# Altium project BLDC controller.PrjPcb
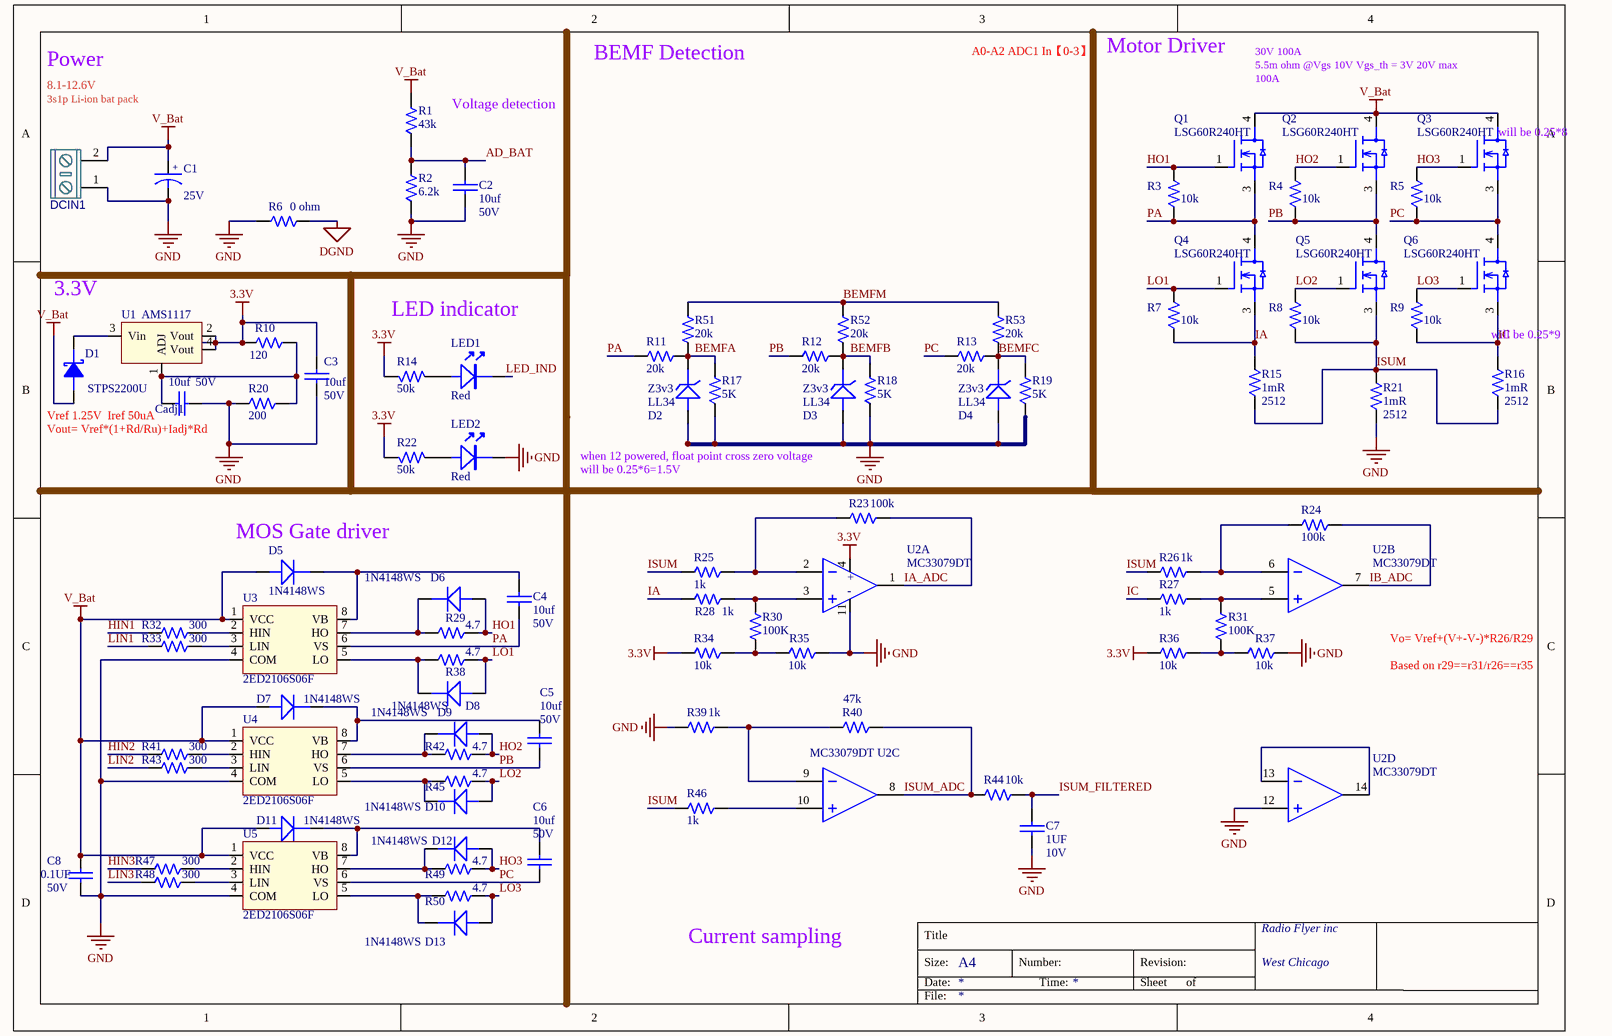
[diagram p0: E-scooter.SchDoc]
3 sheets, 132 parts. Net scope: global (net labels, ports and power ports of the same name join across sheets).
Board files: BLDC controller.PcbDoc, BLDC controlle_V2y.PcbDoc, BLDC controlle_V3.PcbDoc
Sheets:
  E-scooter.SchDoc
  Connector.SchDoc
  MCU.SchDoc

## Sheet E-scooter.SchDoc
size A4; Organization: Altium Limited; Address1: L3, 12a Rodborough Rd; Address2: Frenchs Forest; Address3: NSW; Address4: Australia 2086

### Parts
(Parts that share a designator on the sheet are numbered #1, #2 ... from top to bottom, then left to right.)
C1  Voltage: 25V  [CASE - G]  (hidden comment: PBE099550-4710)
C2  value 10uf  Voltage: 50V  [CAPC0603-RW]  (hidden comment: PXL456470-1530)
C3  value 10uf  Voltage: 50V  [CAPC0603-RW]  (hidden comment: PXL456470-1530)
C4  value 10uf  Voltage: 50V  [CAPC0603-RW]  (hidden comment: PXL456470-1530)
C5  value 10uf  Voltage: 50V  [CAPC0603-RW]  (hidden comment: PXL456470-1530)
C6  value 10uf  Voltage: 50V  [CAPC0603-RW]  (hidden comment: PXL456470-1530)
C7  value 1UF  Voltage: 10V  [CAPC0603-SW]  (hidden comment: PXL456470-1530)
C8  value 0.1UF  Voltage: 50V  [CAPC0603-RW]  (hidden comment: PXL456470-1530)
Cadj1  value 10uf  Voltage: 50V  [CAPC0603-RW]  (hidden comment: PXL456470-1530)
D1  MFG Part: STPS2200U  [SMB]  (hidden comment: DIO STPS2200U)
D2  MFG Part: Z3v3  [LL34]  (hidden comment: RCZ005015-0020)
D3  MFG Part: Z3v3  [LL34]  (hidden comment: RCZ005015-0020)
D4#1  MFG Part: Z3v3  [LL34]  (hidden comment: RCZ005015-0020)
D5#1  RCD114148-0020  [SOD-323]  (value not drawn)
D6#1  RCD114148-0020  [SOD-323]  (value not drawn)
D7#1  RCD114148-0020  [SOD-323]  (value not drawn)
D8#1  RCD114148-0020  [SOD-323]  (value not drawn)
D9  RCD114148-0020  [SOD-323]  (value not drawn)
D10  RCD114148-0020  [SOD-323]  (value not drawn)
D11  RCD114148-0020  [SOD-323]  (value not drawn)
D12  RCD114148-0020  [SOD-323]  (value not drawn)
D13  RCD114148-0020  [SOD-323]  (value not drawn)
DCIN1  KF/WJ/DG 30x connecter  [KF/WJ/DG 301-2p-5.0mm]  (value not drawn)
LED1  Color: Red  [LED1206-RED]  (hidden comment: LED1206R_23-21\R6C-AM1N2AY\2A)
LED2#1  Color: Red  [LED1206-RED]  (hidden comment: LED1206R_23-21\R6C-AM1N2AY\2A)
Q1  MFG Part: LSG60R240HT  [TO252-3]  (hidden comment: T5860038503A6)
Q2  MFG Part: LSG60R240HT  [TO252-3]  (hidden comment: T5860038503A6)
Q3  MFG Part: LSG60R240HT  [TO252-3]  (hidden comment: T5860038503A6)
Q4  MFG Part: LSG60R240HT  [TO252-3]  (hidden comment: T5860038503A6)
Q5  MFG Part: LSG60R240HT  [TO252-3]  (hidden comment: T5860038503A6)
Q6  MFG Part: LSG60R240HT  [TO252-3]  (hidden comment: T5860038503A6)
R1  value 43k  [0603-RW]  (hidden comment: T5024421083A9)
R2  value 6.2k  [0603-RW]  (hidden comment: T5024421083A9)
R3  value 10k  [0603-RW]  (hidden comment: T5024421083A9)
R4  value 10k  [0603-RW]  (hidden comment: T5024421083A9)
R5  value 10k  [0603-RW]  (hidden comment: T5024421083A9)
R6  value 0 ohm  [0603-RW]  (hidden comment: T502210202399)
R7  value 10k  [0603-RW]  (hidden comment: T5024421083A9)
R8  value 10k  [0603-RW]  (hidden comment: T5024421083A9)
R9  value 10k  [0603-RW]  (hidden comment: T5024421083A9)
R10  value 120  [0603-RW]  (hidden comment: T5024421083A9)
R11  value 20k  [0603-RW]  (hidden comment: T5024421083A9)
R12  value 20k  [0603-RW]  (hidden comment: T5024421083A9)
R13  value 20k  [0603-RW]  (hidden comment: T5024421083A9)
R14  value 50k  [0603-RW]  (hidden comment: T5024421083A9)
R15  value 1mR  [2512]  (hidden comment: QCF101250-1009)
R16  value 1mR  [2512]  (hidden comment: QCF101250-1009)
R17  value 5K  [0603-RW]  (hidden comment: T5024421083A9)
R18  value 5K  [0603-RW]  (hidden comment: T5024421083A9)
R19  value 5K  [0603-RW]  (hidden comment: T5024421083A9)
R20  value 200  [0603-RW]  (hidden comment: T5024421083A9)
R21  value 1mR  [2512]  (hidden comment: QCF101250-1009)
R22  value 50k  [0603-RW]  (hidden comment: T5024421083A9)
R23  value 100k  [0603-RW]  (hidden comment: T5024421083A9)
R24  value 100k  [0603-RW]  (hidden comment: T5024421083A9)
R25  value 1k  [0603-RW]  (hidden comment: T5024421083A9)
R26  value 1k  [0603-RW]  (hidden comment: T5024421083A9)
R27#1  value 1k  [0603-RW]  (hidden comment: T5024421083A9)
R28  value 1k  [0603-RW]  (hidden comment: T5024421083A9)
R29  value 4.7  [0603-RW]  (hidden comment: T5024421083A9)
R30#1  value 100K  [0603-RW]  (hidden comment: T5024421083A9)
R31  value 100K  [0603-RW]  (hidden comment: T5024421083A9)
R32#1  value 300  [0603-RW]  (hidden comment: T5024421083A9)
R33  value 300  [0603-RW]  (hidden comment: T5024421083A9)
R34  value 10k  [0603-RW]  (hidden comment: T5024421083A9)
R35  value 10k  [0603-RW]  (hidden comment: T5024421083A9)
R36  value 10k  [0603-RW]  (hidden comment: T5024421083A9)
R37  value 10k  [0603-RW]  (hidden comment: T5024421083A9)
R38  value 4.7  [0603-RW]  (hidden comment: T5024421083A9)
R39  value 1k  [0603-RW]  (hidden comment: T5024421083A9)
R40#1  value 47k  [0603-RW]  (hidden comment: T5024421083A9)
R41  value 300  [0603-RW]  (hidden comment: T5024421083A9)
R42  value 4.7  [0603-RW]  (hidden comment: T5024421083A9)
R43  value 300  [0603-RW]  (hidden comment: T5024421083A9)
R44  value 10k  [0603-RW]  (hidden comment: T5024421083A9)
R45  value 4.7  [0603-RW]  (hidden comment: T5024421083A9)
R46  value 1k  [0603-RW]  (hidden comment: T5024421083A9)
R47  value 300  [0603-RW]  (hidden comment: T5024421083A9)
R48  value 300  [0603-RW]  (hidden comment: T5024421083A9)
R49  value 4.7  [0603-RW]  (hidden comment: T5024421083A9)
R50  value 4.7  [0603-RW]  (hidden comment: T5024421083A9)
R51  value 20k  [0603-RW]  (hidden comment: T5024421083A9)
R52  value 20k  [0603-RW]  (hidden comment: T5024421083A9)
R53#1  value 20k  [0603-RW]  (hidden comment: T5024421083A9)
U1  AMS1117  [SOT223]
U2  RCI033079-0002  [SO14]  (value not drawn)  (parts A,B,C,D of 4)
U3  T610900027257  [SO8]  (value not drawn)
U4  T610900027257  [SO8]  (value not drawn)
U5  T610900027257  [SO8]  (value not drawn)

### Nets
3.3V: C3.1 R10.2 R14.1 R22.1 R34.2 R36.2 U1.2(Vout) U1.4(Vout) U2.4(+V)
DGND: R6.2
GND: C1.2 C2.2 C3.2 C7.1 C8.1 Cadj1.2 D2.1(A) D3.1(A) D4#1.1(A) DCIN1.1 LED2#1.2(K) R2.2 R6.1 R17.2 R18.2 R19.2 R20.2 R21.1 R35.1 R37.1 R39.2 U2.11(-V) U2.12(IN+) U3.4(COM) U4.4(COM) U5.4(COM)
V_Bat: C1.1 C8.2 D1.1(A) D5#1.1(A) D7#1.1(A) D11.1(A) DCIN1.2 Q1.4(D) Q2.4(D) Q3.4(D) R1.1 U3.1(VCC) U4.1(VCC) U5.1(VCC)
AD_BAT: C2.1 R1.2 R2.1
BEMFA: D2.2(K) R11.1 R17.1 R51.2
BEMFB: D3.2(K) R12.1 R18.1 R52.2
BEMFC: D4#1.2(K) R13.1 R19.1 R53#1.2
BEMFM: R51.1 R52.1 R53#1.1
HIN1: R32#1.2
HIN2: R41.2
HIN3: R47.2
HO1: D6#1.1(A) Q1.1(G) R3.2 R29.1
HO2: D9.1(A) Q2.1(G) R4.2 R42.1
HO3: D12.1(A) Q3.1(G) R5.2 R49.1
IA: Q4.3(S) R7.1 R15.2 R28.2
IA_ADC: R23.1 U2.1(OUT)
IB_ADC: R24.1 U2.7(OUT)
IC: Q6.3(S) R9.1 R16.2 R27#1.2
ISUM: Q5.3(S) R8.1 R15.1 R16.1 R21.2 R25.2 R26.2 R46.2
ISUM_ADC: R40#1.1 R44.2 U2.8(OUT)
ISUM_FILTERED: C7.2 R44.1
LED_IND: LED1.2(K)
LIN1: R33.2
LIN2: R43.2
LIN3: R48.2
LO1: D8#1.1(A) Q4.1(G) R7.2 R38.1
LO2: D10.1(A) Q5.1(G) R8.2 R45.1
LO3: D13.1(A) Q6.1(G) R9.2 R50.1
PA: C4.1 Q1.3(S) Q4.4(D) R3.1 R11.2 U3.6(VS)
PB: C5.1 Q2.3(S) Q5.4(D) R4.1 R12.2 U4.6(VS)
PC: C6.1 Q3.3(S) Q6.4(D) R5.1 R13.2 U5.6(VS)
NetC4_2: C4.2 D5#1.2(K) U3.8(VB)
NetC5_2: C5.2 D7#1.2(K) U4.8(VB)
NetC6_2: C6.2 D11.2(K) U5.8(VB)
NetCadj1_1: Cadj1.1 R10.1 R20.1 U1.1(ADJ)
NetD1_2: D1.2(K) U1.3(Vin)
NetD6#1_2: D6#1.2(K) R29.2 U3.7(HO)
NetD8#1_2: D8#1.2(K) R38.2 U3.5(LO)
NetD9_2: D9.2(K) R42.2 U4.7(HO)
NetD10_2: D10.2(K) R45.2 U4.5(LO)
NetD12_2: D12.2(K) R49.2 U5.7(HO)
NetD13_2: D13.2(K) R50.2 U5.5(LO)
NetLED1_1: LED1.1(A) R14.2
NetLED2#1_1: LED2#1.1(A) R22.2
NetR23_2: R23.2 R25.1 U2.2(IN-)
NetR24_2: R24.2 R26.1 U2.6(IN-)
NetR27#1_1: R27#1.1 R31.1 U2.5(IN+)
NetR28_1: R28.1 R30#1.1 U2.3(IN+)
NetR30#1_2: R30#1.2 R34.1 R35.2
NetR31_2: R31.2 R36.1 R37.2
NetR32#1_1: R32#1.1 U3.2(HIN)
NetR33_1: R33.1 U3.3(LIN)
NetR39_1: R39.1 R40#1.2 U2.9(IN-)
NetR41_1: R41.1 U4.2(HIN)
NetR43_1: R43.1 U4.3(LIN)
NetR46_1: R46.1 U2.10(IN+)
NetR47_1: R47.1 U5.2(HIN)
NetR48_1: R48.1 U5.3(LIN)
NetU2_13: U2.13(IN-) U2.14(OUT)

### Notes on the sheet
- Power
- 3s1p Li-ion bat pack
- 8.1-12.6V
- (near R1) Voltage detection
- BEMF Detection
- A0-A2 ADC1 In【0-3】
- Motor Driver
- 30V 100A
- 5.5m ohm @Vgs 10V Vgs_th = 3V 20V max
- (near Q1) 100A
- (near Q3) will be 0.25*8
- 3.3V
- LED indicator
- will be 0.25*9
- (near Cadj1) Vref 1.25V  Iref 50uA
- Vout= Vref*(1+Rd/Ru)+Iadj*Rd
- when 12 powered, float point cross zero voltage
- will be 0.25*6=1.5V
- (near D5#1) MOS Gate driver
- Vo= Vref+(V+-V-)*R26/R29
- Based on r29==r31/r26==r35
- Current sampling
- Title
- Size:
- Date:
- A4
- Number:
- Time:
- Revision:
- Sheet
- of
- Radio Flyer inc
- West Chicago
- File:
- (in symbol CAP E 470uF 25V 20% SMD) +
- (in symbol MC33079DT, part A) +; -

### Library data of the parts
C1 = CAP E 470uF 25V 20% SMD: CHIP ELECT 470uF 25V 20% D10xL10 105; SAP: T551471445000; Vendor Name: 东莞市晴远电子有限公司; Vendor Code: 10010262; Type: Capacitor; DIP&SMD: SMD; PACKAGE: CASE - G; MFG: *; MFG Part: *; Other: *; Tolerance: 20%; Customer Specific: N/A
C2-C8 = CAP0603 0.015uF 50V 10%: GP CHIP CAP 0.015uF 50V 10% 0603 TYPE X7R; SAP: T542021537508; Vendor Code: 10010262; Vendor Name: 东莞市晴远电子有限公司; Type: Capacitor; DIP&SMD: SMD; PACKAGE: CAPC0603; MFG: *; MFG Part: *; Other: X7R; Tolerance: 10%; Customer Specific: N/A
Cadj1 = CAP0603 0.015uF 50V 10%: GP CHIP CAP 0.015uF 50V 10% 0603 TYPE X7R; SAP: T542021537508; Vendor Code: 10010262; Vendor Name: 东莞市晴远电子有限公司; DIP&SMD: SMD; PACKAGE: CAPC0603; MFG: *; MFG Part: *; Other: X7R; Tolerance: 10%; Type: Capacitor; Customer Specific: N/A
D1 = DIO STPS2200U: DIODE SCHOTTKY 200V 2A SMB; MFG: STMicroelectronics; DIP&SMD: SMD; CREATE_NAME: Nathan; SAP: *; Vendor Name: *; Vendor Code: *; Voltage: *; Current: *; Type: DIODE; Customer Specific: N/A; CREATE_TIME: 19-Jun-2020; Package: SMB
D2 D3 D4#1 = TCLLZ15V: CHIP ZENER 15V 0.5W MLL34; SAP: T573003832016; Vendor Code: 10009207; Vendor Name: MOBICON HOLDINGS LTD.; MFG: TAK CHEONG; Current: 5MA; Tolerance: 5%; Power: 500MW; DIP&SMD: SMD; VOLTAGE: 15V; Type: ZENER; Customer Specific: N/A; Package: LL34
D5#1 D6#1 D7#1 D8#1 D9-D13 = 1N4148WS: DIODE SW 1N4148 VF=0.7V SOD-323; MFG: TW SEMICONDUCTOR; SAP: T572005070208; Voltage: 100V; Current: 150MA; DIP&SMD: SMD; Vendor Name: *; Vendor Code: *; Type: DIODE; Package: SOD-323; Customer Specific: N/A; MFG Part: 1N4148WS
DCIN1 = KF/WJ/DG 30x: 接线端子 2Pin
LED1 LED2#1 = LED1206R_23-21\R6C-AM1N2AY\2A: CHIP LED RED TYPE 1206; MFG: EVERLIGHT; DIP&SMD: SMD; CREATE_NAME: Nathan; MFG Part: 23-21\R6C-AM1N2AY\2A; SAP: *; Package: 1206; Type: LED; CREATE_TIME: 18-Aug-2020
Q1-Q6 = NMOS LSG60R240HT: NMOS 600V LSG60R240HT TO252( LONTEN K; Current: 17A; Type: N-CHANNEL MOSFET; CREATE_NAME: Nathan; DIP&SMD: SMD; SAP: T5860038503A6; Pd: *; Vendor Code: *; Vendor Name: *; Voltage: 600V; MFG: LONTEN; CREATE_TIME: 12-Oct-2019; Rds: *; Customer Specific: N/A; Package: TO252
R1-R5 R7-R14 R17-R20 R22-R26 R27#1 R28 R29 R30#1 R31 R32#1 R33-R39 R40#1 R41-R52 R53#1 = RES0201 1/20W 1% 4.42K OHM_WALSIN: CHIP 4.42K OHM 200PPM +-1% 0201 WALS L; MFG Part: WR02X4421FAL; Power: 1/20W; MFG: WALSIN (華新); TOL: 1%; CREATE_NAME: Nathan; DIP&SMD: SMD; Vendor Code: *; SAP: T5024421083A9; Vendor Name: *; Type: Resistor; PACKAGE: 0603; CREATE_TIME: 23-July-2019; Customer Specific: N/A
R6 = RES0603 1/16W 1% 21K OMH_WALSIN: CHIP 21K OHM 100PPM +-1% 0603 WALS L; TOL: 1%; MFG: WALSIN (華新); Power: 1/10W; CREATE_NAME: Nathan; DIP&SMD: SMD; SAP: T502210202399; Package: 0603; MFG Part: *; Vendor Code: *; Vendor Name: *; Type: Resistor; CREATE_TIME: 08-Feb-2018; Customer Specific: N/A
R15 R16 R21 = RES2512 1W 1% 10 OHM: CHIP RES. 10 OHM 1W 1% 2512; Vendor Code: 10010262; SAP: T502100A07399; Vendor Name: 东莞市晴远电子有限公司; DIP&SMD: SMD; Power: 1W; MFG Part: *; MFG: *; TOL: 1%; Type: Resistor; Customer Specific: N/A; PACKAGE: 2512
U1 = AMS1117: 800mA LOW DROPOUT VOLTAGE REGULATOR , SOT-223; MFG: Advanced Monolithic Systems; CREATE_NAME: Nathan; DIP&SMD: SMD; SAP: *; Vendor Code: *; Vendor Name: *; Type: IC; CREATE_TIME: 17-Nov-2020; Package: SOT-223; Customer Specific: N/A; MFG Part: AMS1117
U2 = MC33079DT: IC opamp quad MC33079 bipolar SO14; SAP: T610500026102; MFG: STMICROELECTRONICS; DIP&SMD: SMD; Vendor Code: *; Vendor Name: *; Type: IC; Customer Specific: N/A; MFG Part: MC33079DT
U3-U5 = 2ED2106S06F: DRIVER 2ED2106S06F DSO-8 INFINEO K; MFG: Infineon; CREATE_NAME: Nathan; DIP&SMD: SMD; Vendor Code: *; Vendor Name: *; SAP: T610900027257; Type: IC; CREATE_TIME: 14-Apr-2020; Customer Specific: N/A; MFG Part: 2ED2106S06F

## Sheet Connector.SchDoc
size A4; Organization: Altium Limited; Address1: L3, 12a Rodborough Rd; Address2: Frenchs Forest; Address3: NSW; Address4: Australia 2086
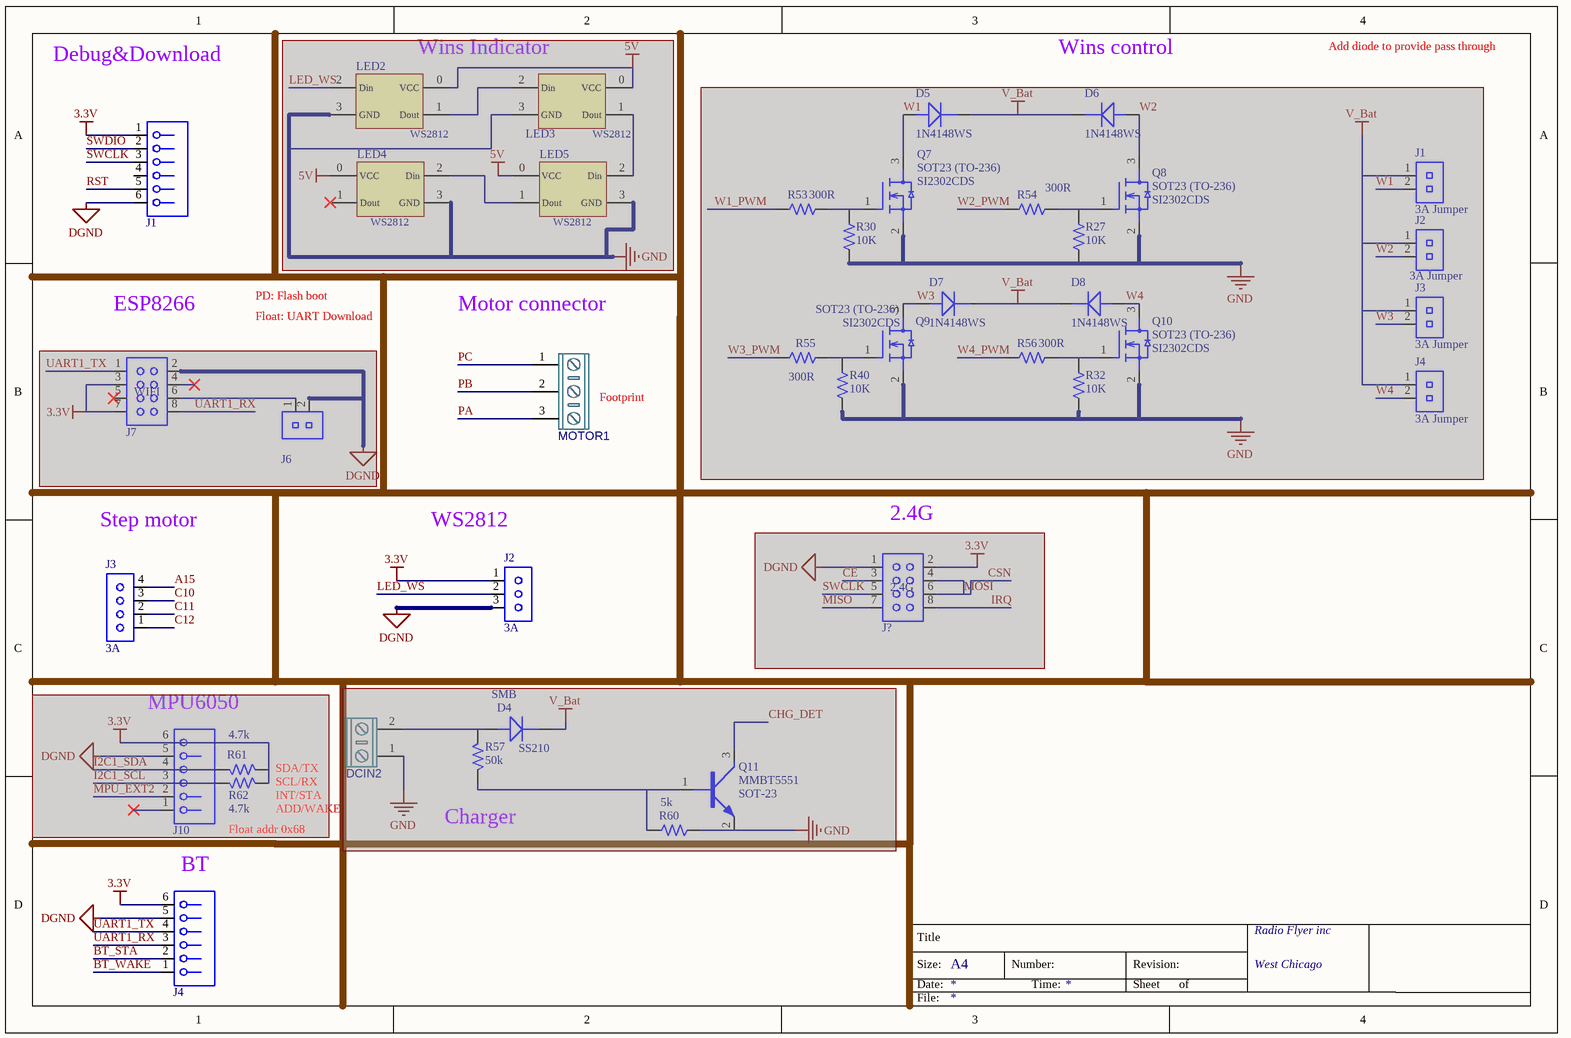
[diagram p1: Connector.SchDoc]

### Parts
(Parts that share a designator on the sheet are numbered #1, #2 ... from top to bottom, then left to right.)
D4#2  RCD102100-0110  [SMB]  (value not drawn)  (masked out: inside a compile mask, not in the netlist)
D5#2  RCD114148-0020  [SOD-323]  (value not drawn)  (masked out: inside a compile mask, not in the netlist)
D6#2  RCD114148-0020  [SOD-323]  (value not drawn)  (masked out: inside a compile mask, not in the netlist)
D7#2  RCD114148-0020  [SOD-323]  (value not drawn)  (masked out: inside a compile mask, not in the netlist)
D8#2  RCD114148-0020  [SOD-323]  (value not drawn)  (masked out: inside a compile mask, not in the netlist)
DCIN2  KF/WJ/DG 30x connecter  [KF/WJ/DG 301-2p-5.0mm]  (value not drawn)  (masked out: inside a compile mask, not in the netlist)
J1#1  Current: 3A Jumper  [HOUSING 2P PH=2.54mm Jumper]  (hidden comment: CCH254020-0102)  (masked out: inside a compile mask, not in the netlist)
J1#2  T690300121600  [CONN 6P PH=2.5mm RA XHB-6AW-KL]  (value not drawn)
J2#1  Current: 3A Jumper  [HOUSING 2P PH=2.54mm Jumper]  (hidden comment: CCH254020-0102)  (masked out: inside a compile mask, not in the netlist)
J2#2  Current: 3A  [HEAD 3P PH=2.54mm 180]  (hidden comment: CCP254010-0103)
J3#1  Current: 3A Jumper  [HOUSING 2P PH=2.54mm Jumper]  (hidden comment: CCH254020-0102)  (masked out: inside a compile mask, not in the netlist)
J3#2  Current: 3A  [HEAD 4P PH=2.54mm 180]  (hidden comment: CCP254260-0104)
J4#1  Current: 3A Jumper  [HOUSING 2P PH=2.54mm Jumper]  (hidden comment: CCH254020-0102)  (masked out: inside a compile mask, not in the netlist)
J4#2  T690300121600  [CONN 6P PH=2.5mm RA XHB-6AW-KL]  (value not drawn)
J6  CCH254020-0102  [HOUSING 2P PH=2.54mm Jumper]  (value not drawn)  (masked out: inside a compile mask, not in the netlist)
J7  WIFI  [HEAD 8P 2X4 PH=2.54mm 90 H5mm_2.54-2X4AW-10.4]  (masked out: inside a compile mask, not in the netlist)
J10  T690300121600  [CONN 6P PH=2.5mm RA XHB-6AW-KL]  (value not drawn)  (masked out: inside a compile mask, not in the netlist)
J?  2.4G  [HEAD 8P 2X4 PH=2.54mm 90 H5mm_2.54-2X4AW-10.4]  (masked out: inside a compile mask, not in the netlist)
LED2#2  WS2812  [WS2812]  (value not drawn)  (masked out: inside a compile mask, not in the netlist)
LED3  WS2812  [WS2812]  (value not drawn)  (masked out: inside a compile mask, not in the netlist)
LED4  WS2812  [WS2812]  (value not drawn)  (masked out: inside a compile mask, not in the netlist)
LED5  WS2812  [WS2812]  (value not drawn)  (masked out: inside a compile mask, not in the netlist)
MOTOR1  KF/WJ/DG 30x connecter  [KF/WJ/DG 301-3p-5.0mm]  (value not drawn)
Q7  Package: SOT23 (TO-236)  [SOT23-132-RW]  (hidden comment: SI2302CDS)  (masked out: inside a compile mask, not in the netlist)
Q8  Package: SOT23 (TO-236)  [SOT23-132-RW]  (hidden comment: SI2302CDS)  (masked out: inside a compile mask, not in the netlist)
Q9  Package: SOT23 (TO-236)  [SOT23-132-RW]  (hidden comment: SI2302CDS)  (masked out: inside a compile mask, not in the netlist)
Q10  Package: SOT23 (TO-236)  [SOT23-132-RW]  (hidden comment: SI2302CDS)  (masked out: inside a compile mask, not in the netlist)
Q11  Package: SOT-23  [SOT23-132-RW]  (hidden comment: RCN005551-0001)  (masked out: inside a compile mask, not in the netlist)
R27#2  value 10K  [0603-RW]  (hidden comment: T5024421083A9)  (masked out: inside a compile mask, not in the netlist)
R30#2  value 10K  [0603-RW]  (hidden comment: T5024421083A9)  (masked out: inside a compile mask, not in the netlist)
R32#2  value 10K  [0603-RW]  (hidden comment: T5024421083A9)  (masked out: inside a compile mask, not in the netlist)
R40#2  value 10K  [0603-RW]  (hidden comment: T5024421083A9)  (masked out: inside a compile mask, not in the netlist)
R53#2  value 300R  [0603-RW]  (hidden comment: T5024421083A9)  (masked out: inside a compile mask, not in the netlist)
R54  value 300R  [0603-RW]  (hidden comment: T5024421083A9)  (masked out: inside a compile mask, not in the netlist)
R55  value 300R  [0603-RW]  (hidden comment: T5024421083A9)  (masked out: inside a compile mask, not in the netlist)
R56  value 300R  [0603-RW]  (hidden comment: T5024421083A9)  (masked out: inside a compile mask, not in the netlist)
R57  value 50k  [0603-RW]  (hidden comment: T5024421083A9)  (masked out: inside a compile mask, not in the netlist)
R60  value 5k  [0603-RW]  (hidden comment: T5024421083A9)  (masked out: inside a compile mask, not in the netlist)
R61  value 4.7k  [0603-RW]  (hidden comment: T5024421083A9)  (masked out: inside a compile mask, not in the netlist)
R62  value 4.7k  [0603-RW]  (hidden comment: T5024421083A9)  (masked out: inside a compile mask, not in the netlist)

### Nets
3.3V: J1#2.1 J2#2.1 J4#2.6
DGND: J1#2.6 J2#2.3 J4#2.5
A15: J3#2.4
BT_STA: J4#2.2
BT_WAKE: J4#2.1
C10: J3#2.3
C11: J3#2.2
C12: J3#2.1
LED_WS: J2#2.2
PA: MOTOR1.3
PB: MOTOR1.2
PC: MOTOR1.1
RST: J1#2.5
SWCLK: J1#2.3
SWDIO: J1#2.2
UART1_RX: J4#2.3
UART1_TX: J4#2.4

Not connected (* = marked no-connect by the designer): J1#2 4

### Notes on the sheet
- Debug&Download
- Wins Indicator
- Wins control
- Add diode to provide pass through
- ESP8266
- PD: Flash boot
- (near MOTOR1) Motor connector
- Float: UART Download
- (near MOTOR1) Footprint
- (near J?) 2.4G
- Step motor
- (near J2#2) WS2812
- (near J10) MPU6050
- SDA/TX
- SCL/RX
- Float addr 0x68
- INT/STA
- ADD/WAKE
- (near R57) Charger
- BT
- Title
- Size:
- Date:
- A4
- Number:
- Time:
- Revision:
- Sheet
- of
- Radio Flyer inc
- West Chicago
- File:

### Library data of the parts
D4#2 = SS210: SWITC 100V 2A SS210 MIC G; SAP: T572005362246; Vendor Name: 深圳市春明电子有限公司; Vendor Code: 10020343; Type: DIODE; Optional: USD (和572004962246 交易幣別不一樣)帋ISHIDDEN=T|IS|IS|IS|IS|IS|IS; DIP&SMD: SMD; MFG: MIC; Voltage: 100V; Current: 2A; Customer Specific: N/A; MFG Part: SS210; Package: SMB
D5#2 D6#2 D7#2 D8#2 = 1N4148WS: as D5#1 on sheet E-scooter; Vendor Name: *; Vendor Code: *; Type: DIODE; Package: SOD-323; Customer Specific: N/A; MFG Part: 1N4148WS
DCIN2 = KF/WJ/DG 30x: 接线端子 2Pin
J1#1 J2#1 J3#1 J4#1 = HOUSING 2P PH=2.54mm Jumper: HOUSING SIL Jumper 2P 90059-1007 Molex; Value: 2.54mm; SAP: T690300000900; Vendor Name: 深圳市利民丰电子有限公司; Vendor Code: 10020373; DIP&SMD: DIP; MFG: *; MFG Part: *; Type: Connector
J1#2 J4#2 J10 = CONN PH 6P PH=2.5mm RA XHB-6AW-KL: CONNECTOR 6PIN P=2.5 WHITE 90 K; Value: 2.5mm; MFG: 金佳电子; CREATE_NAME: Nathan; DIP&SMD: DIP; SAP: T690300121600; MFG Part: XHB-6AW-KL; Vendor Name: *; Vendor Code: *; Type: Connector; Current: *; CREATE_TIME: 27-Sep-2017
J2#2 = HEAD 3P PH=2.54mm 180: HEAD PIN 3P P2.54*H11.6MM; Value: 2.54mm; SAP: T690300031100; Vendor Name: 深圳市利民丰电子有限公司; Vendor Code: 10020373; DIP&SMD: DIP; MFG: *; MFG Part: *; Type: Connector
J3#2 = HEAD 4P PH=2.54mm 180 H11.5mm: HEAD PIN 4P P2.54xH11.5MM; Value: 2.54mm; SAP: T690300023200; Vendor Name: 亿源电子有限公司; Vendor Code: 10009989; DIP&SMD: DIP; MFG: *; MFG Part: *; Type: Connector
J6 = HOUSING 2P PH=2.54mm Jumper: HOUSING SIL Jumper 2P 90059-1007 Molex; Value: 2.54mm; SAP: T690300000900; Vendor Name: 深圳市利民丰电子有限公司; Vendor Code: 10020373; DIP&SMD: DIP; Current: 3A Jumper; MFG: *; MFG Part: *; Type: Connector
J7 J? = HEAD 8P 2X4 PH=2.54mm 90 H5mm_2.54-2X4AW-10.4: 2X4P P:2.54MM 90° DIP K; Value: 2.54mm; SAP: T690300110000; MFG: JINJIA; CREATE_NAME: Nathan; MFG Part: 2.54-2X4AW-10.4; Vendor Name: *; Vendor Code: *; Type: Connector; Current: *; CREATE_TIME: 12-Sep-2017; DIP&SMD: DIP
MOTOR1 = KF/WJ/DG 30x-3P: 接线端子 3Pin
Q7-Q10 = SI2302CDS: NMOS FET-Si2302CDS; MFG: VISHAY; CREATE_NAME: Nathan; DIP&SMD: SMD; SAP: *; Power: *; Vendor Code: *; Vendor Name: *; Voltage: *; Current: *; Type: NMOS; CREATE_TIME: 17-Nov-2020; Customer Specific: N/A; MFG Part: SI2302CDS
Q11 = MMBT5551: XISTR NPN MMBT5551 SOT-23 FAIRCHILD; SAP: T581001790453; MFG: 宣瑜; Vendor Code: 10020343; Vendor Name: 深圳市春明电子有限公司; DIP&SMD: SMD; Power: *; Voltage: *; Type: NPN; Customer Specific: N/A; MFG Part: MMBT5551
R27#2 R30#2 R32#2 R40#2 R53#2 R54-R57 R60-R62 = RES0201 1/20W 1% 4.42K OHM_WALSIN: as R1 on sheet E-scooter; Vendor Code: *; SAP: T5024421083A9; Vendor Name: *; Type: Resistor; PACKAGE: 0603; CREATE_TIME: 23-July-2019; Customer Specific: N/A

## Sheet MCU.SchDoc
size A4
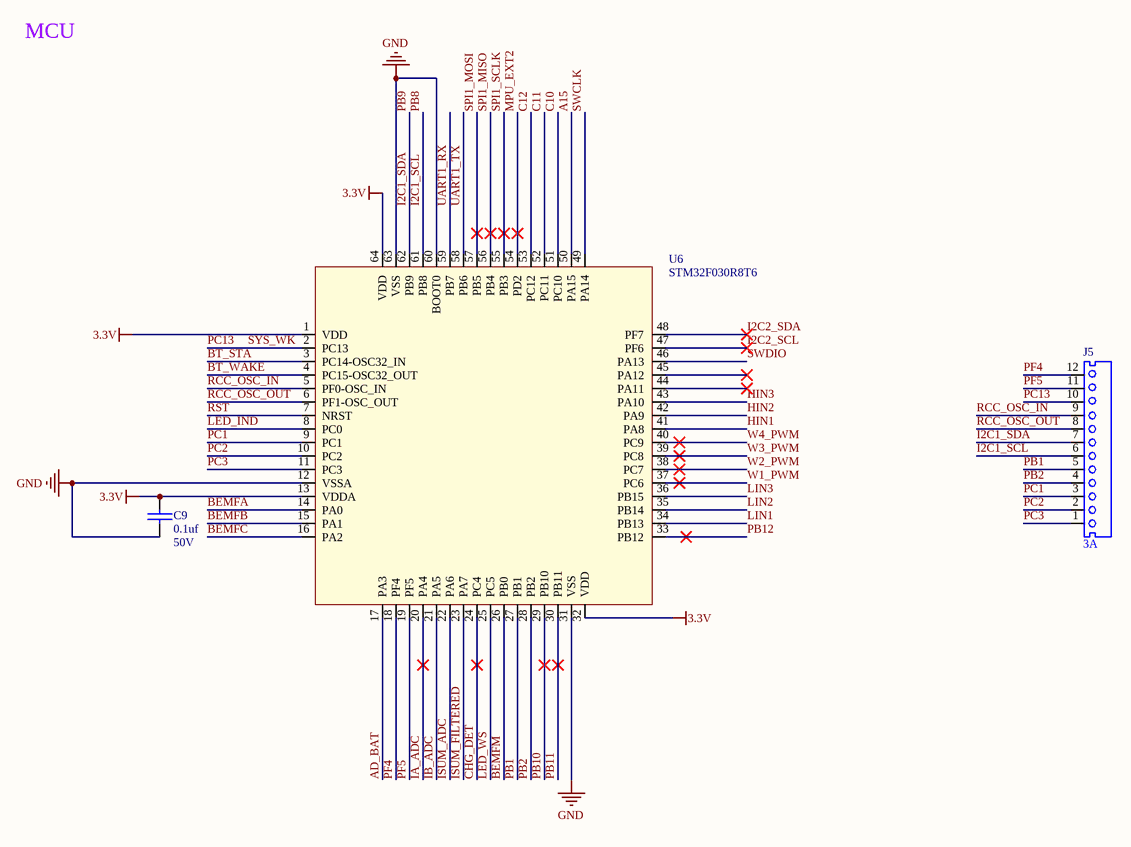
[diagram p2: MCU.SchDoc]

### Parts
C9  value 0.1uf  Voltage: 50V  [CAPC0603-RW]  (hidden comment: PXL456470-1530)
J5  Current: 3A  [CONN 12P PH=2.5 ST HAA250A-12A]  (hidden comment: T690300029300)
U6  MFG Part: STM32F030R8T6  [QFP50P1200X1200X160-64N]  (hidden comment: T610300097225)

### Nets
3.3V: C9.2 U6.1(VDD) U6.13(VDDA) U6.32(VDD) U6.64(VDD)
GND: C9.1 U6.12(VSSA) U6.31(VSS) U6.60(BOOT0) U6.63(VSS)
A15: U6.50(PA15)
AD_BAT: U6.17(PA3)
BEMFA: U6.14(PA0)
BEMFB: U6.15(PA1)
BEMFC: U6.16(PA2)
BEMFM: U6.26(PB0)
BT_STA: U6.3(PC14-OSC32_IN)
BT_WAKE: U6.4(PC15-OSC32_OUT)
C10: U6.51(PC10)
C11: U6.52(PC11)
C12: U6.53(PC12)
CHG_DET: U6.24(PC4)
HIN1: U6.41(PA8)
HIN2: U6.42(PA9)
HIN3: U6.43(PA10)
I2C1_SCL: J5.6 U6.61(PB8)  [also labelled PB8]
I2C1_SDA: J5.7 U6.62(PB9)  [also labelled PB9]
I2C2_SCL: U6.47(PF6)
I2C2_SDA: U6.48(PF7)
IA_ADC: U6.20(PA4)
IB_ADC: U6.21(PA5)
ISUM_ADC: U6.22(PA6)
ISUM_FILTERED: U6.23(PA7)
LED_IND: U6.8(PC0)
LED_WS: U6.25(PC5)
LIN1: U6.34(PB13)
LIN2: U6.35(PB14)
LIN3: U6.36(PB15)
MPU_EXT2: U6.54(PD2)
PB1: J5.5 U6.27(PB1)
PB2: J5.4 U6.28(PB2)
PB10: U6.29(PB10)
PB11: U6.30(PB11)
PB12: U6.33(PB12)
PC1: J5.3 U6.9(PC1)
PC2: J5.2 U6.10(PC2)
PC3: J5.1 U6.11(PC3)
PC13: J5.10 U6.2(PC13)  [also labelled SYS_WK]
PF4: J5.12 U6.18(PF4)
PF5: J5.11 U6.19(PF5)
RCC_OSC_IN: J5.9 U6.5(PF0-OSC_IN)
RCC_OSC_OUT: J5.8 U6.6(PF1-OSC_OUT)
RST: U6.7(NRST)
SPI1_MISO: U6.56(PB4)
SPI1_MOSI: U6.57(PB5)
SPI1_SCLK: U6.55(PB3)
SWCLK: U6.49(PA14)
SWDIO: U6.46(PA13)
UART1_RX: U6.59(PB7)
UART1_TX: U6.58(PB6)
W1_PWM: U6.37(PC6)
W2_PWM: U6.38(PC7)
W3_PWM: U6.39(PC8)
W4_PWM: U6.40(PC9)

Not connected (* = marked no-connect by the designer): U6 44(PA11)* 45(PA12)*

### Notes on the sheet
- MCU
- Title
- Size:
- Date:
- A4
- Number:
- Time:
- Revision:
- Sheet
- of
- Radio Flyer inc
- West Chicago
- File:

### Library data of the parts
C9 = CAP0603 0.015uF 50V 10%: as C2 on sheet E-scooter; PACKAGE: CAPC0603; MFG: *; MFG Part: *; Other: X7R; Tolerance: 10%; Customer Specific: N/A
J5 = CONN 12P PH=2.5 ST HAA250A-12A: CONNECTOR 12 PIN P:2.5MM P2.54-12 K; Value: 2.5mm; MFG: 金科基; CREATE_NAME: Nathan; DIP&SMD: DIP; SAP: T690300029300; MFG Part: HAA250A-12A; Vendor Name: *; Vendor Code: *; Type: Connector; CREATE_TIME: 10-Aug-2017
U6 = STM32F030RCT6TR: MCU STM32F030RCT6TR LQFP64 ST K; MFG: ST     (STM意法半導體); CREATE_NAME: Nathan; DIP&SMD: SMD; SAP: T610300097225; Type: IC; CREATE_TIME: 02-NOV-2017; Customer Specific: N/A

## Nets that join several sheets
3.3V: E-scooter (9 pins), Connector (J1#2.1 J2#2.1 J4#2.6), MCU (5 pins)
DGND: E-scooter (R6.2), Connector (J1#2.6 J2#2.3 J4#2.5)
GND: E-scooter (26 pins), MCU (5 pins)
A15: Connector (J3#2.4), MCU (U6.50)
AD_BAT: E-scooter (C2.1 R1.2 R2.1), MCU (U6.17)
BEMFA: E-scooter (D2.2 R11.1 R17.1 R51.2), MCU (U6.14)
BEMFB: E-scooter (D3.2 R12.1 R18.1 R52.2), MCU (U6.15)
BEMFC: E-scooter (D4#1.2 R13.1 R19.1 R53#1.2), MCU (U6.16)
BEMFM: E-scooter (R51.1 R52.1 R53#1.1), MCU (U6.26)
BT_STA: Connector (J4#2.2), MCU (U6.3)
BT_WAKE: Connector (J4#2.1), MCU (U6.4)
C10: Connector (J3#2.3), MCU (U6.51)
C11: Connector (J3#2.2), MCU (U6.52)
C12: Connector (J3#2.1), MCU (U6.53)
HIN1: E-scooter (R32#1.2), MCU (U6.41)
HIN2: E-scooter (R41.2), MCU (U6.42)
HIN3: E-scooter (R47.2), MCU (U6.43)
IA_ADC: E-scooter (R23.1 U2.1), MCU (U6.20)
IB_ADC: E-scooter (R24.1 U2.7), MCU (U6.21)
ISUM_ADC: E-scooter (R40#1.1 R44.2 U2.8), MCU (U6.22)
ISUM_FILTERED: E-scooter (C7.2 R44.1), MCU (U6.23)
LED_IND: E-scooter (LED1.2), MCU (U6.8)
LED_WS: Connector (J2#2.2), MCU (U6.25)
LIN1: E-scooter (R33.2), MCU (U6.34)
LIN2: E-scooter (R43.2), MCU (U6.35)
LIN3: E-scooter (R48.2), MCU (U6.36)
PA: E-scooter (6 pins), Connector (MOTOR1.3)
PB: E-scooter (6 pins), Connector (MOTOR1.2)
PC: E-scooter (6 pins), Connector (MOTOR1.1)
RST: Connector (J1#2.5), MCU (U6.7)
SWCLK: Connector (J1#2.3), MCU (U6.49)
SWDIO: Connector (J1#2.2), MCU (U6.46)
UART1_RX: Connector (J4#2.3), MCU (U6.59)
UART1_TX: Connector (J4#2.4), MCU (U6.58)